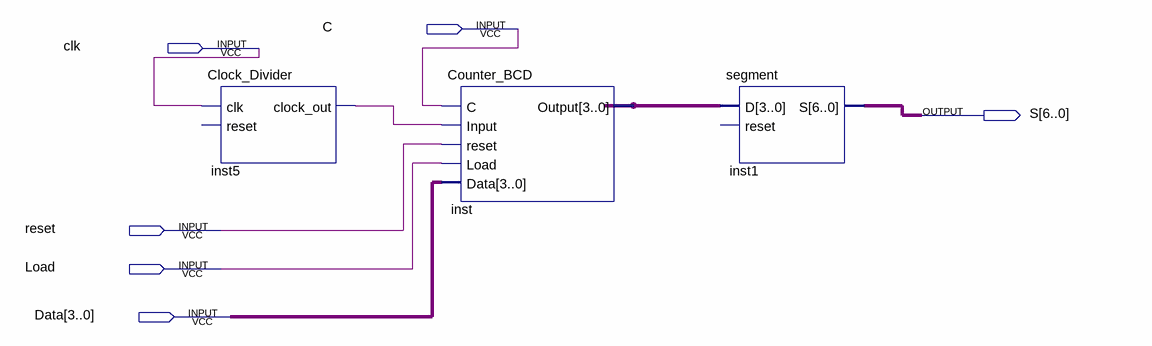
[diagram p0: schematic sheet]
// Quartus schematic div.bdf as structural Verilog: 3 symbols, 6 pins
module div (
  input  C,
  input  clk,
  input  reset,
  input  Load,
  input  [3:0] Data,
  output [6:0] S
);

  wire inst5_clock_out;
  wire [3:0] inst_output;

  Clock_Divider inst5 (.clk(clk), .clock_out(inst5_clock_out));  // open: reset
  Counter_BCD inst (.C(C), .Input(inst5_clock_out), .reset(reset), .Load(Load), .Data(Data), .Output(inst_output));
  segment inst1 (.D(inst_output), .S(S));  // open: reset
endmodule
